# EAGLE design Control Board (EAGLE 6.3)
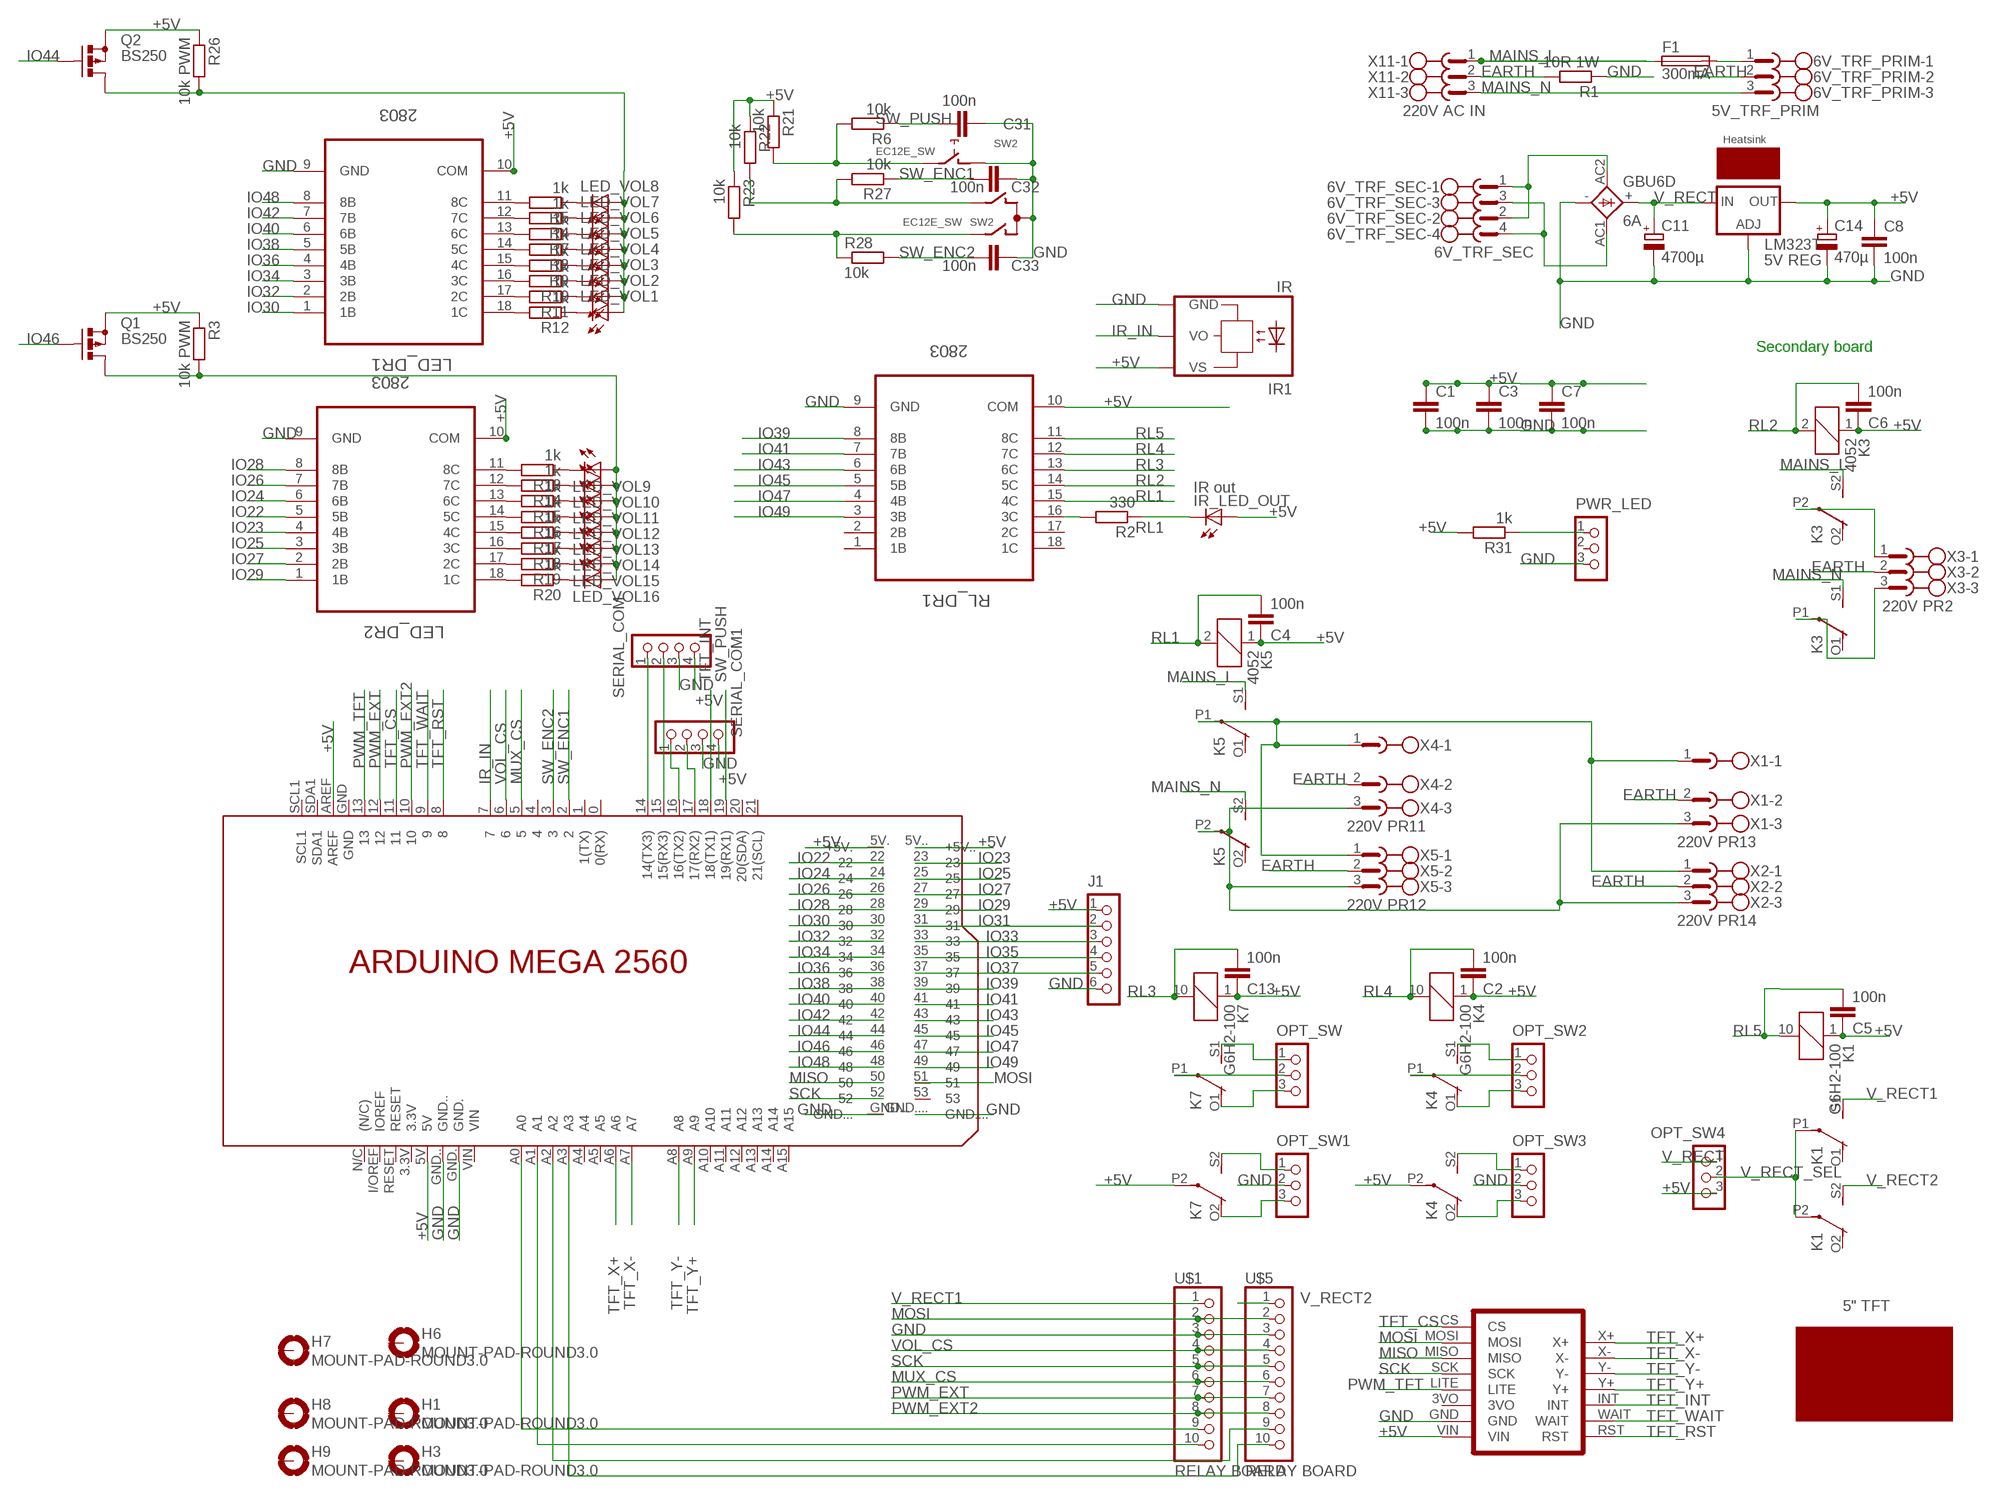
[diagram p0: schematic, sheet 1]

## Parts
6V_TRF_PRIM  5V_TRF_PRIM  MSTBV3  [MSTBV3]
6V_TRF_SEC  6V_TRF_SEC  MSTBV4  [MSTBV4]
C1  100n  C-EU050-025X075  [C050-025X075]
C2  100n  C-EU050-025X075  [C050-025X075]
C3  100n  C-EU050-025X075  [C050-025X075]
C4  100n  C-EU050-025X075  [C050-025X075]
C5  100n  C-EU050-025X075  [C050-025X075]
C6  100n  C-EU050-025X075  [C050-025X075]
C7  100n  C-EU050-025X075  [C050-025X075]
C8  100n  C-EU050-025X075  [C050-025X075]
C11  4700µ  CPOL-EUE7.5-16  [E7,5-16]
C13  100n  C-EU050-025X075  [C050-025X075]
C14  470µ  CPOL-EUE2.5-6  [E2,5-6]
C31  100n  C-EU050-025X075  [C050-025X075]
C32  100n  C-EU050-025X075  [C050-025X075]
C33  100n  C-EU050-025X075  [C050-025X075]
F1  300mA  GSH15  [GSH15]
GBU6D  6A  GBU4  [GBU4S]
H1  MOUNT-PAD-ROUND3.0  [3,0-PAD]
H3  MOUNT-PAD-ROUND3.0  [3,0-PAD]
H6  MOUNT-PAD-ROUND3.0  [3,0-PAD]
H7  MOUNT-PAD-ROUND3.0  [3,0-PAD]
H8  MOUNT-PAD-ROUND3.0  [3,0-PAD]
H9  MOUNT-PAD-ROUND3.0  [3,0-PAD]
IR1  IR  TSOP1738TB1  [TSOP17_TB1]
IR_LED_OUT  IR out  TLLG4400  [LED3MM]
J1  CON_HEADER_1X06-PTH  [M1X6]
K1  G6H2-100  [G6H2-100]
K3  4052  [F4052]
K4  G6H2-100  [G6H2-100]
K5  4052  [F4052]
K7  G6H2-100  [G6H2-100]
LED_DR1  2803  ULN2803ADWR  [SOIC127P1030X265-18N]
LED_DR2  2803  ULN2803ADWR  [SOIC127P1030X265-18N]
LED_VOL1  TLLG4400  [LED3MM]
LED_VOL2  TLLG4400  [LED3MM]
LED_VOL3  TLLG4400  [LED3MM]
LED_VOL4  TLLG4400  [LED3MM]
LED_VOL5  TLLG4400  [LED3MM]
LED_VOL6  TLLG4400  [LED3MM]
LED_VOL7  TLLG4400  [LED3MM]
LED_VOL8  TLLG4400  [LED3MM]
LED_VOL9  TLLG4400  [LED3MM]
LED_VOL10  TLLG4400  [LED3MM]
LED_VOL11  TLLG4400  [LED3MM]
LED_VOL12  TLLG4400  [LED3MM]
LED_VOL13  TLLG4400  [LED3MM]
LED_VOL14  TLLG4400  [LED3MM]
LED_VOL15  TLLG4400  [LED3MM]
LED_VOL16  TLLG4400  [LED3MM]
LM323T  5V REG  LM138-TSTO220S_IAO  [TO220S]
OPT_SW  CON_HEADER_1X03-PTH  [M1X3]
OPT_SW1  CON_HEADER_1X03-PTH  [M1X3]
OPT_SW2  CON_HEADER_1X03-PTH  [M1X3]
OPT_SW3  CON_HEADER_1X03-PTH  [M1X3]
OPT_SW4  V_RECT_-_5V_OUT  CON_HEADER_1X03-PTH  [M1X3]
PCB2  ARDUINO_MEGA2560_INV  [ARDUINO_MEGA2560_INV]
PWR_LED  CON_HEADER_1X03-PTH  [M1X3]
Q1  BS250  [SOT54E]
Q2  BS250  [SOT54E]
R1  10R 1W  R-EU_0411/15  [0411/15]
R2  330  R-EU_0207/10  [0207/10]
R3  10k PWM  R-EU_0207/10  [0207/10]
R4  1k  R-EU_0207/10  [0207/10]
R5  1k  R-EU_0207/10  [0207/10]
R6  10k  R-EU_0207/10  [0207/10]
R7  1k  R-EU_0207/10  [0207/10]
R8  1k  R-EU_0207/10  [0207/10]
R9  1k  R-EU_0207/10  [0207/10]
R10  1k  R-EU_0207/10  [0207/10]
R11  1k  R-EU_0207/10  [0207/10]
R12  1k  R-EU_0207/10  [0207/10]
R13  1k  R-EU_0207/10  [0207/10]
R14  1k  R-EU_0207/10  [0207/10]
R15  1k  R-EU_0207/10  [0207/10]
R16  1k  R-EU_0207/10  [0207/10]
R17  1k  R-EU_0207/10  [0207/10]
R18  1k  R-EU_0207/10  [0207/10]
R19  1k  R-EU_0207/10  [0207/10]
R20  1k  R-EU_0207/10  [0207/10]
R21  10k  R-EU_0207/10  [0207/10]
R22  10k  R-EU_0207/10  [0207/10]
R23  10k  R-EU_0207/10  [0207/10]
R26  10k PWM  R-EU_0207/10  [0207/10]
R27  10k  R-EU_0207/10  [0207/10]
R28  10k  R-EU_0207/10  [0207/10]
R31  1k  R-EU_0207/10  [0207/10]
RL_DR1  2803  ULN2803ADWR  [SOIC127P1030X265-18N]
SERIAL_COM  CON_HEADER_1X04  [M1X4]
SERIAL_COM1  CON_HEADER_1X04  [M1X4]
SW2  EC12E_SW  [ALPS_EC12E_SW]
U$1  RELAY BOARD  PINHD-1X10  [1X10-BIG]
U$2  HEATSINK  [HEATSINK]
U$3  RA8875  [RA8875]
U$4  5"TFT  [5_TFT]
U$5  RELAY BOARD  PINHD-1X10  [1X10-BIG]
X1  220V PR13  MSTBV3  [MSTBV3]
X2  220V PR14  MSTBV3  [MSTBV3]
X3  220V PR2  MSTBV3  [MSTBV3]
X4  220V PR11  MSTBV3  [MSTBV3]
X5  220V PR12  MSTBV3  [MSTBV3]
X11  220V AC IN  MSTBV3  [MSTBV3]

## Nets
+5V [power]: C1.1 C2.1 C3.1 C4.1 C5.1 C6.1 C7.1 C8.1 C13.1 C14.+ IR1.VS IR_LED_OUT.A J1.1 K1.1 K3.1 K4.1 K4.P2(3:P) K5.1 K7.1 K7.P2(3:P) LED_DR1.10(COM) LED_DR2.10(COM) LM323T.3(OUT) OPT_SW4.3 PCB2.5V PCB2.5V.(+5V.) PCB2.5V..(+5V..) PCB2.AREF Q1.S Q2.S R3.1 R21.1 R22.1 R23.1 R26.1 R31.2 RL_DR1.10(COM) SERIAL_COM1.4 SERIAL_COM.4 U$3.VIN
EARTH [earth]: 6V_TRF_PRIM.2 R1.2 X1.2 X2.2 X3.2 X4.2 X5.2 X11.2
GND [power]: C1.2 C3.2 C7.2 C8.2 C11.- C14.- C31.1 C32.1 C33.1 GBU6D.- IR1.GND J1.6 LED_DR1.9(GND) LED_DR2.9(GND) LM323T.2(ADJ) OPT_SW1.2 OPT_SW3.2 PCB2.GND. PCB2.GND.. PCB2.GND... PCB2.GND.... PWR_LED.3 R1.1 RL_DR1.9(GND) SERIAL_COM1.3 SERIAL_COM.3 SW2.C SW2.D U$1.3 U$3.GND U$5.3
IO22: LED_DR2.5(5B) PCB2.22
IO23: LED_DR2.4(4B) PCB2.23
IO24: LED_DR2.6(6B) PCB2.24
IO25: LED_DR2.3(3B) PCB2.25
IO26: LED_DR2.7(7B) PCB2.26
IO27: LED_DR2.2(2B) PCB2.27
IO28: LED_DR2.8(8B) PCB2.28
IO29: LED_DR2.1(1B) PCB2.29
IO30: LED_DR1.1(1B) PCB2.30
IO31: J1.2 PCB2.31
IO32: LED_DR1.2(2B) PCB2.32
IO33: J1.3 PCB2.33
IO34: LED_DR1.3(3B) PCB2.34
IO35: J1.4 PCB2.35
IO36: LED_DR1.4(4B) PCB2.36
IO37: J1.5 PCB2.37
IO38: LED_DR1.5(5B) PCB2.38
IO39: PCB2.39 RL_DR1.8(8B)
IO40: LED_DR1.6(6B) PCB2.40
IO41: PCB2.41 RL_DR1.7(7B)
IO42: LED_DR1.7(7B) PCB2.42
IO43: PCB2.43 RL_DR1.6(6B)
IO44: PCB2.44 Q2.G
IO45: PCB2.45 RL_DR1.5(5B)
IO46: PCB2.46 Q1.G
IO47: PCB2.47 RL_DR1.4(4B)
IO48: LED_DR1.8(8B) PCB2.48
IO49: PCB2.49 RL_DR1.3(3B)
IR_IN: IR1.VO PCB2.7
LED_COMMON_1 [power]: LED_VOL1.A LED_VOL2.A LED_VOL3.A LED_VOL4.A LED_VOL5.A LED_VOL6.A LED_VOL7.A LED_VOL8.A Q2.D R26.2
LED_COMMON_2 [power]: LED_VOL9.A LED_VOL10.A LED_VOL11.A LED_VOL12.A LED_VOL13.A LED_VOL14.A LED_VOL15.A LED_VOL16.A Q1.D R3.2
MAINS_L [mains]: F1.1 K3.S2(3:S) K5.S1(2:S) X11.1
MAINS_N [mains]: 6V_TRF_PRIM.3 K3.S1(2:S) K5.S2(3:S) X11.3
MISO: PCB2.50 U$3.MISO
MOSI: PCB2.51 U$1.2 U$3.MOSI U$5.2
MUX_CS: PCB2.5 U$1.6 U$5.6
N$1: K4.P1(2:P) OPT_SW2.2
N$2: R2.2 RL_DR1.16(3C)
N$3: IR_LED_OUT.K(C) R2.1
N$4: LED_VOL1.K(C) R12.1
N$5: PCB2.14(14(TX3)) SERIAL_COM.1
N$6: PCB2.15(15(RX3)) SERIAL_COM.2
N$7: LED_DR1.11(8C) R5.2
N$8: K4.S1(2:S) OPT_SW2.1
N$9: K4.O1(2:O) OPT_SW2.3
N$10: LED_VOL2.K(C) R11.1
N$11: R6.2 R21.2 SW2.E
N$12: LED_VOL3.K(C) R10.1
N$13: LED_VOL4.K(C) R9.1
N$14: LED_VOL5.K(C) R8.1
N$15: LED_VOL6.K(C) R7.1
N$16: LED_VOL7.K(C) R4.1
N$17: LED_VOL8.K(C) R5.1
N$18: LED_DR2.11(8C) R13.2
N$19: LED_DR2.12(7C) R14.2
N$21: LED_DR2.13(6C) R15.2
N$22: LED_DR2.14(5C) R16.2
N$23: LED_DR2.15(4C) R17.2
N$24: LED_DR2.16(3C) R18.2
N$25: LED_DR2.17(2C) R19.2
N$26: LED_DR2.18(1C) R20.2
N$27: K7.S2(3:S) OPT_SW1.1
N$28: R22.2 R27.2 SW2.B
N$29: LED_DR1.12(7C) R4.2
N$31: LED_DR1.13(6C) R7.2
N$32: K7.P1(2:P) OPT_SW.2
N$33: LED_DR1.14(5C) R8.2
N$34: LED_DR1.15(4C) R9.2
N$35: LED_DR1.16(3C) R10.2
N$36: LED_DR1.17(2C) R11.2
N$37: LED_DR1.18(1C) R12.2
N$38 [power]: 6V_TRF_SEC.3 6V_TRF_SEC.4 GBU6D.AC1(AC2)
N$39 [power]: 6V_TRF_SEC.1 6V_TRF_SEC.2 GBU6D.AC2(AC1)
N$40: K7.O2(3:O) OPT_SW1.3
N$41: LED_VOL9.K(C) R13.1
N$42: LED_VOL10.K(C) R14.1
N$43: LED_VOL11.K(C) R15.1
N$53: LED_VOL12.K(C) R16.1
N$54: LED_VOL13.K(C) R17.1
N$55: LED_VOL14.K(C) R18.1
N$56 [main2]: K3.P1(2:P) X3.3
N$57: LED_VOL15.K(C) R19.1
N$58: LED_VOL16.K(C) R20.1
N$59: K7.S1(2:S) OPT_SW.1
N$60: PCB2.16(16(TX2)) SERIAL_COM1.1
N$61: PCB2.17(17(RX2)) SERIAL_COM1.2
N$62: R23.2 R28.1 SW2.A
N$64: K4.S2(3:S) OPT_SW3.1
N$65 [main2]: K3.P2(3:P) X3.1
N$73 [mains]: 6V_TRF_PRIM.1 F1.2
N$74: K7.O1(2:O) OPT_SW.3
N$75: PCB2.A0 U$1.9
N$84: PCB2.A1 U$1.10
N$85: PCB2.A2 U$5.9
N$86: PCB2.A3 U$5.10
N$123: K4.O2(3:O) OPT_SW3.3
N$138: PWR_LED.1 R31.1
N$139 [mains]: K5.P1(2:P) X1.1 X2.1 X4.1 X5.1
N$141 [main2]: K5.P2(3:P) X1.3 X2.3 X4.3 X5.3
PWM_EXT: PCB2.12 U$1.7 U$5.7
PWM_EXT2: PCB2.10 U$1.8 U$5.8
PWM_TFT: PCB2.13 U$3.LITE
RL1: C4.2 K5.2 RL_DR1.15(4C)
RL2: C6.2 K3.2 RL_DR1.14(5C)
RL3: C13.2 K7.10 RL_DR1.13(6C)
RL4: C2.2 K4.10 RL_DR1.12(7C)
RL5: C5.2 K1.10 RL_DR1.11(8C)
SCK: PCB2.52 U$1.5 U$3.SCK U$5.5
SW_ENC1: C32.2 PCB2.2 R27.1
SW_ENC2: C33.2 PCB2.3 R28.2
SW_PUSH: C31.2 PCB2.19(19(RX1)) R6.1
TFT_CS: PCB2.11 U$3.CS
TFT_INT: PCB2.18(18(TX1)) U$3.INT
TFT_RST: PCB2.8 U$3.RST
TFT_WAIT: PCB2.9 U$3.WAIT
TFT_X+: PCB2.A6 U$3.X+
TFT_X-: PCB2.A7 U$3.X-
TFT_Y+: PCB2.A9 U$3.Y+
TFT_Y-: PCB2.A8 U$3.Y-
V_RECT [power]: C11.+ GBU6D.+ LM323T.1(IN) OPT_SW4.1
V_RECT1 [power]: K1.S1(2:S) U$1.1
V_RECT2 [power]: K1.S2(3:S) U$5.1
V_RECT_SEL [power]: K1.P1(2:P) K1.P2(3:P) OPT_SW4.2
VOL_CS: PCB2.6 U$1.4 U$5.4
Unconnected: H1.B3,0(MOUNT) H3.B3,0(MOUNT) H6.B3,0(MOUNT) H7.B3,0(MOUNT) H8.B3,0(MOUNT) H9.B3,0(MOUNT) K1.O1(2:O) K1.O2(3:O) K3.O1(2:O) K3.O2(3:O) K5.O1(2:O) K5.O2(3:O) PCB2.0(0(RX)) PCB2.1(1(TX)) PCB2.3.3V PCB2.4 PCB2.20(20(SDA)) PCB2.21(21(SCL)) PCB2.53 PCB2.A4 PCB2.A5 PCB2.A10 PCB2.A11 PCB2.A12 PCB2.A13 PCB2.A14 PCB2.A15 PCB2.GND PCB2.I/OREF(IOREF) PCB2.N/C((N/C)) PCB2.RESET PCB2.SCL1 PCB2.SDA1 PCB2.VIN PWR_LED.2 RL_DR1.1(1B) RL_DR1.2(2B) RL_DR1.17(2C) RL_DR1.18(1C) SW2.GND1(G) SW2.GND2(G) U$3.3VO

## Notes on the sheet
- Secondary board

## Library data of the parts
6V_TRF_PRIM X1-X5 X11 = con-phoenix-508:MSTBV3: PHOENIX; MPN: MSTBV 2,5/3-GF-5.08; OC_FARNELL: 1792793; OC_NEWARK: 69R9846
6V_TRF_SEC = con-phoenix-508:MSTBV4: PHOENIX; MPN: MSTBV 2,5/4-GF-5.08; OC_FARNELL: 1792794; OC_NEWARK: 69R9847
C1-C8 C13 C31-C33 = rcl:C-EU: CAPACITOR, European symbol
C11 C14 = rcl:CPOL-EU: POLARIZED CAPACITOR, European symbol
F1 = fuse:GSH15: FUSE HOLDER grid 15mm, 19649 Wickmann; MPN: 64900001039; OC_FARNELL: 1271673; OC_NEWARK: 02P0318
GBU6D = rectifier:GBU4: GENERAL INSTRUMENT RECTIFIER
H1 H3 H6-H9 = holes:MOUNT-PAD-ROUND: MOUNTING PAD, round
IR1 = telefunken:TSOP17*TB1: TSOP17..TB1 IR Receiver Modules for Remote Control Systems Source: http://www.vishay.com/docs/82042/82042.pdf; OC_FARNELL: unknown; OC_NEWARK: unknown
IR_LED_OUT LED_VOL1-LED_VOL16 = led:TLLG4400: Low Current (2mA) LED 3 mm Tinted Diffused Package color GREEN Source: Data sheet <http://www.farnell.com/datasheets/391098.pdf>; MF: VISHAY SEMICONDUCTOR; OC_FARNELL: 1612435
J1 = dp_devices.v6:CON_HEADER_1X06
K1 K4 K7 = relay:G6H2-100: RELAY 2 x switch, 0.5 A/125 V AC, 1 A/30 V DC, Omron; OC_FARNELL: unknown; OC_NEWARK: unknown
K3 K5 = relay:4052: RELAY 2 x switch, Finder; OC_FARNELL: unknown; OC_NEWARK: unknown
LED_DR1 LED_DR2 RL_DR1 = uln-udn:ULN2803ADWR: Darlington transistor array; MPN: ULN2803ADWR; OC_FARNELL: 1652420; OC_NEWARK: 87H4769; PACKAGE: SOIC-18; SUPPLIER: TEXAS INSTRUMENTS
LM323T = v-reg:LM138-TS: VOLTAGE REGULATOR
OPT_SW OPT_SW1-OPT_SW4 PWR_LED = dp_devices.v6:CON_HEADER_1X03
PCB2 = E14_Arduino_revB:ARDUINO_MEGA2560_INV
Q1 Q2 = transistor-small-signal:BS250: P-CHANNEL MOS FET
R1-R23 R26-R28 R31 = rcl:R-EU_: RESISTOR, European symbol
SERIAL_COM SERIAL_COM1 = dp_devices.v6:CON_HEADER_1X04
SW2 = switch-alps:EC12E_SW: ALPS rotary Encoder EC12E series with switch; MPN: EC12E2424407; OC_FARNELL: 1520813; OC_NEWARK: 74M1068
U$1 U$5 = adafruit:PINHD-1X10: Pin header 1x10 0.1" spacing With round pins
U$2 = gael:HEATSINK
U$3 = gael:RA8875
U$4 = gael:5"TFT

## Net classes
0 default: width 0.254 mm, clearance 0.203 mm
1 mains: width 0.508 mm, clearance 2.5 mm
2 earth: width 1.27 mm, clearance 0.508 mm
3 main2: width 0.508 mm, clearance 1.5 mm
4 power: width 0.508 mm, clearance 0.203 mm

## Board
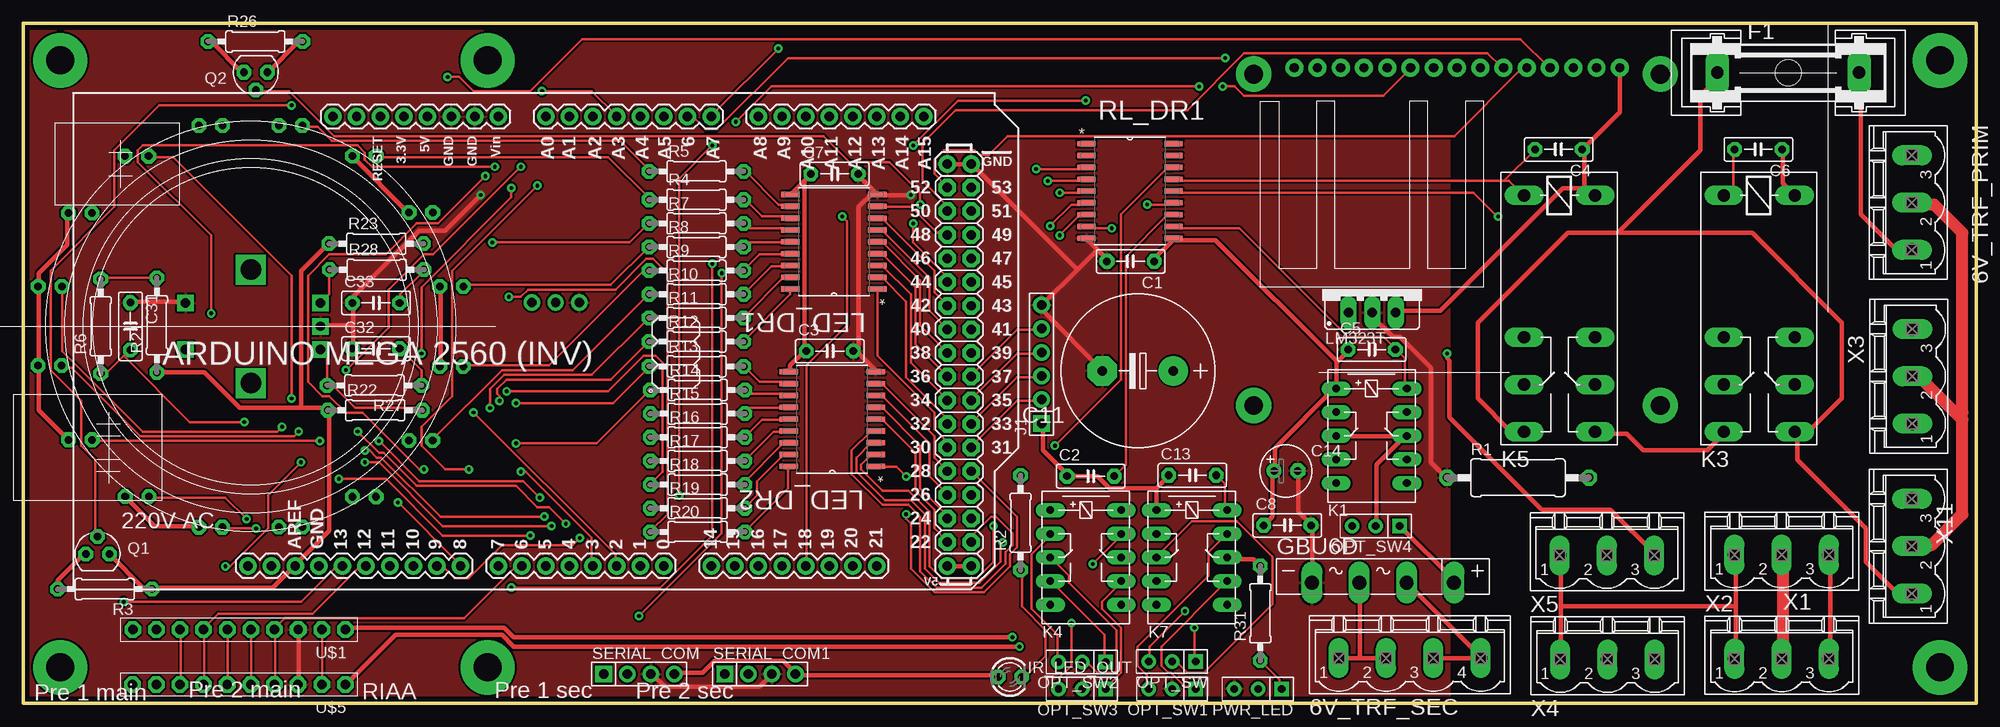
[diagram p1: board, top side]
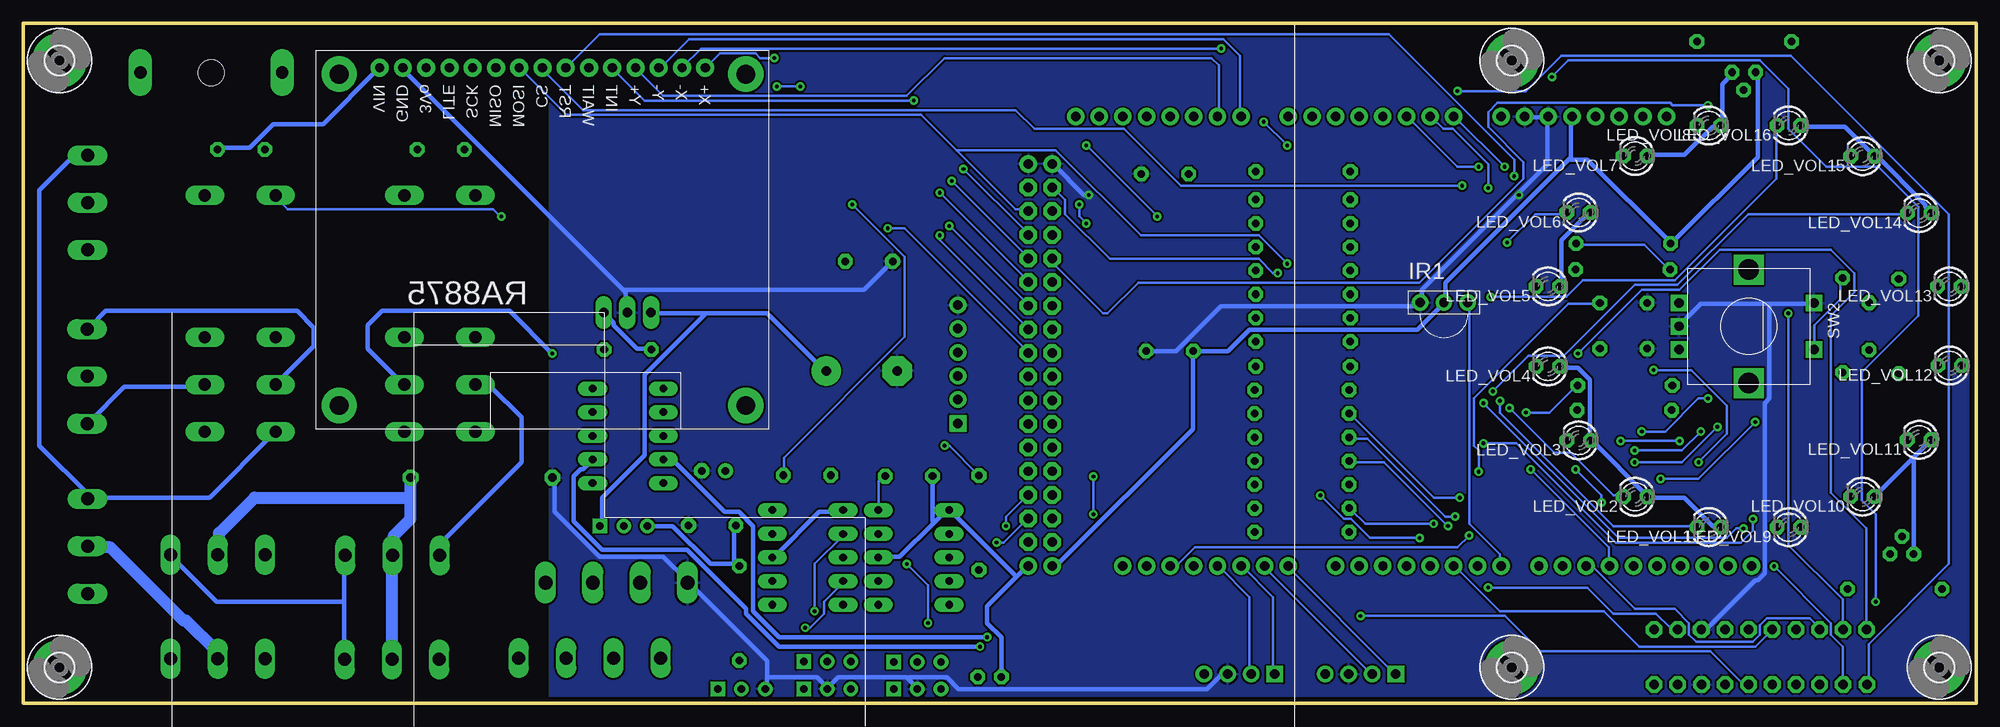
[diagram p2: board, bottom side, seen from below]

Size 209.89 x 73.08 mm. Coordinates in mm from the lower left corner, seen from the top.
Outline: 209.89,0 0,0 0,73.08 209.89,73.08 209.89,0
Copper layers (1*16): Top 0.035mm / dielectric 1.5mm / Bottom 0.035mm
Design rules "gael design rules": minimum track width 0.2mm, minimum drill 0.4mm, track to track 8mil, track to pad 8mil, pad to pad 8mil, via to via 8mil, smd to smd 8mil, copper to edge 20mil, drill to drill 8mil, minimum pad ring 15mil, minimum via ring 10mil, stop-mask expansion 4mil, vias tented up to drill 0mil, thermal gap 10mil

### Footprints (pad centres in the part's own frame; a part is rotated, then mirrored left to right if it is on the bottom)
MSTBV3 = drill 1.397 long: 1 -5.08,0; 2 0,0; 3 5.08,0
MSTBV4 = drill 1.397 long: 1 -7.62,0; 2 -2.54,0; 3 2.54,0; 4 7.62,0
C050-025X075 = drill 0.813 octagon: 1 -2.54,0; 2 2.54,0
E7,5-16 = drill 1.016 pad 3.15: + -3.81,0 | drill 1.016 pad 3.15 octagon: - 3.81,0
E2,5-6 = drill 0.813 pad 1.6: + -1.27,0 | drill 0.813 pad 1.6 octagon: - 1.27,0
GSH15 = drill 1.321 pad 2.54 long: 1 -7.62,0; 2 7.62,0 | hole 2.794: 0,0
GBU4S = drill 1.499 long: + 7.62,0; - -7.62,0; AC1 2.54,0; AC2 -2.54,0
3,0-PAD = drill 3 pad 5.842: B3,0 0,0
TSOP17_TB1 = drill 1 pad 1.676: GND 0,-3.81; VO 0,1.27; VS 0,-1.27
LED3MM = drill 0.813 octagon: A -1.27,0; K 1.27,0
M1X6 = drill 1.02 pad 1.632 square: 1 0,0 | drill 1.02 pad 1.632: 2 2.54,0; 3 5.08,0; 4 7.62,0; 5 10.16,0; 6 12.7,0
G6H2-100 = drill 0.813 long: 1 -5.08,-3.81; 5 5.08,-3.81; 6 5.08,3.81; 10 -5.08,3.81; O1 -2.54,-3.81; O2 -2.54,3.81; P1 0,-3.81; P2 0,3.81; S1 2.54,-3.81; S2 2.54,3.81
F4052 = drill 1.321 long: 1 -3.81,3.81; 2 -3.81,-3.81; O1 11.43,-3.81; O2 11.43,3.81; P1 16.51,-3.81; P2 16.51,3.81; S1 21.59,-3.81; S2 21.59,3.81
SOIC127P1030X265-18N = smd 1.981 x 0.559: 1 -4.674,5.08; 2 -4.674,3.81; 3 -4.674,2.54; 4 -4.674,1.27; 5 -4.674,0; 6 -4.674,-1.27; 7 -4.674,-2.54; 8 -4.674,-3.81; 9 -4.674,-5.08; 10 4.674,-5.08; 11 4.674,-3.81; 12 4.674,-2.54; 13 4.674,-1.27; 14 4.674,0; 15 4.674,1.27; 16 4.674,2.54; 17 4.674,3.81; 18 4.674,5.08
TO220S = drill 1.016 long: 1 -2.54,-2.54; 2 0,-2.54; 3 2.54,-2.54
M1X3 = drill 0.8 square: 1 0,0 | drill 0.8: 2 2.54,0; 3 5.08,0
ARDUINO_MEGA2560_INV = drill 1.016 pad 1.88: 0 63.5,2.54; 1 60.96,2.54; 2 58.42,2.54; 3 55.88,2.54; 3.3V 35.56,50.8; 4 53.34,2.54; 5 50.8,2.54; 5V 38.1,50.8; 5V. 93.98,2.54; 5V.. 96.52,2.54; 6 48.26,2.54; 7 45.72,2.54; 8 41.656,2.54; 9 39.116,2.54; 10 36.576,2.54; 11 34.036,2.54; 12 31.496,2.54; 13 28.956,2.54; 14 68.58,2.54; 15 71.12,2.54; 16 73.66,2.54; 17 76.2,2.54; 18 78.74,2.54; 19 81.28,2.54; 20 83.82,2.54; 21 86.36,2.54; A0 50.8,50.8; A1 53.34,50.8; A2 55.88,50.8; A3 58.42,50.8; A4 60.96,50.8; A5 63.5,50.8; A6 66.04,50.8; A7 68.58,50.8; A8 73.66,50.8; A9 76.2,50.8; A10 78.74,50.8; A11 81.28,50.8; A12 83.82,50.8; A13 86.36,50.8; A14 88.9,50.8; A15 91.44,50.8; AREF 23.876,2.54; GND 26.416,2.54; GND. 43.18,50.8; GND.. 40.64,50.8; GND... 93.98,45.72; GND.... 96.52,45.72; I/OREF 30.48,50.8; N/C 27.94,50.8; RESET 33.02,50.8; SCL1 18.796,2.54; SDA1 21.336,2.54; VIN 45.72,50.8 | drill 1.016 pad 1.88 octagon: 22 93.98,5.08; 23 96.52,5.08; 24 93.98,7.62; 25 96.52,7.62; 26 93.98,10.16; 27 96.52,10.16; 28 93.98,12.7; 29 96.52,12.7; 30 93.98,15.24; 31 96.52,15.24; 32 93.98,17.78; 33 96.52,17.78; 34 93.98,20.32; 35 96.52,20.32; 36 93.98,22.86; 37 96.52,22.86; 38 93.98,25.4; 39 96.52,25.4; 40 93.98,27.94; 41 96.52,27.94; 42 93.98,30.48; 43 96.52,30.48; 44 93.98,33.02; 45 96.52,33.02; 46 93.98,35.56; 47 96.52,35.56; 48 93.98,38.1; 49 96.52,38.1; 50 93.98,40.64; 51 96.52,40.64; 52 93.98,43.18; 53 96.52,43.18
SOT54E = drill 0.813 octagon: D -1.27,0; G 0,1.905; S 1.27,0
0411/15 = drill 0.914 octagon: 1 -7.62,0; 2 7.62,0
0207/10 = drill 0.813 octagon: 1 -5.08,0; 2 5.08,0
M1X4 = drill 1.02 pad 1.632 square: 1 0,0 | drill 1.02 pad 1.632: 2 2.54,0; 3 5.08,0; 4 7.62,0
ALPS_EC12E_SW = drill 1 square: A -2.5,-7.5; B 2.5,-7.5; C 0,-7.5; D -2.5,7; E 2.5,7 | drill 2.2 square: GND1 -6.1,0; GND2 6.1,0
1X10-BIG = drill 1.016 pad 1.778 octagon: 1 -11.43,0; 2 -8.89,0; 3 -6.35,0; 4 -3.81,0; 5 -1.27,0; 6 1.27,0; 7 3.81,0; 8 6.35,0; 9 8.89,0; 10 11.43,0
RA8875 = drill 1 pad 1.93: 3VO 11.85,1.8; CS 24.35,1.8; GND 9.35,1.8; INT 31.85,1.8; LITE 14.35,1.8; MISO 19.35,1.8; MOSI 21.85,1.8; RST 26.85,1.8; SCK 16.85,1.8; VIN 6.85,1.8; WAIT 29.35,1.8; X+ 41.85,1.8; X- 39.35,1.8; Y+ 34.35,1.8; Y- 36.85,1.8 | drill 2 pad 3.81: P$1 2.5,2.5; P$2 46.2,2.5; P$3 2.5,38.1; P$4 46.2,38.1

### Placement (x,y rotation side)
6V_TRF_PRIM  202.97,53.8 90 top
6V_TRF_SEC  149.01,4.86 0 top
C1  119.01,47.5 180 top
C2  114.71,24.41 0 top
C3  86.68,37.85 0 top
C4  165.01,59.53 180 top
C5  144.93,38.02 0 top
C6  186.47,59.53 180 top
C7  87.19,56.9 0 top
C8  135.85,19.13 0 top
C11  119.78,35.72 180 top
C13  125.65,24.51 0 top
C14  135.7,24.98 0 top
C31  11.52,40.51 270 top
C32  37.91,38.11 0 top
C33  37.91,43.03 0 top
F1  189.68,67.77 0 top
GBU6D  146.14,12.98 0 top
H1  206,69.09 0 bottom
H3  3.97,69.09 0 bottom
H6  49.91,3.87 0 bottom
H7  206,3.87 0 bottom
H8  49.91,69.09 0 bottom
H9  3.97,3.87 0 bottom
IR1  55.94,43.07 270 bottom
IR_LED_OUT  106.03,2.84 0 top
J1  109.43,30.09 90 top
K1  144.89,28.75 270 top
K3  186.57,50.77 270 top
K4  114.2,15.68 270 top
K5  165.11,50.77 270 top
K7  125.6,15.68 270 top
LED_DR1  87.13,49.59 180 top
LED_DR2  86.94,30.54 180 top
LED_VOL1  28.74,18.94 180 bottom
LED_VOL2  36.65,22.2 180 bottom
LED_VOL3  42.73,28.26 180 bottom
LED_VOL4  46.03,36.21 180 bottom
LED_VOL5  46.03,44.81 180 bottom
LED_VOL6  42.73,52.75 180 bottom
LED_VOL7  36.66,58.81 180 bottom
LED_VOL8  28.74,62.09 180 bottom
LED_VOL9  20.14,18.93 180 bottom
LED_VOL10  12.23,22.21 180 bottom
LED_VOL11  6.13,28.32 180 bottom
LED_VOL12  2.85,36.3 180 bottom
LED_VOL13  2.87,44.8 180 bottom
LED_VOL14  6.12,52.68 180 bottom
LED_VOL15  12.21,58.79 180 bottom
LED_VOL16  20.15,62.09 180 bottom
LM323T  144.97,44.52 0 top
OPT_SW  126.01,4.49 180 top
OPT_SW1  126.02,1.55 180 top
OPT_SW2  116.34,4.46 180 top
OPT_SW3  116.34,1.54 180 top
OPT_SW4  147.91,19.07 180 top
PCB2  5.35,12.24 0 top
PWR_LED  135.24,1.55 180 top
Q1  7.99,16.04 0 top
Q2  24.99,67.81 180 top
R1  160.64,24.25 0 top
R2  107.18,19.41 90 top
R3  8.77,12.28 180 top
R4  72.35,54.12 0 top
R5  72.35,57.17 0 top
R6  8.32,40.52 90 top
R7  72.35,51.58 0 top
R8  72.35,49.04 0 top
R9  72.35,46.5 0 top
R10  72.35,43.96 0 top
R11  72.35,41.42 0 top
R12  72.35,38.88 0 top
R13  72.35,36.21 0 top
R14  72.47,33.67 0 top
R15  72.47,31.13 0 top
R16  72.47,28.59 0 top
R17  72.47,26.05 0 top
R18  72.47,23.51 0 top
R19  72.47,20.97 0 top
R20  72.47,18.43 0 top
R21  14.36,40.64 90 top
R22  37.81,31.5 0 top
R23  37.94,49.4 0 top
R26  24.94,71.12 0 top
R27  37.74,34.17 180 top
R28  37.99,46.6 0 top
R31  132.95,9.68 90 top
RL_DR1  118.94,55.05 0 top
SERIAL_COM  62.37,3.15 0 top
SERIAL_COM1  75.38,3.15 0 top
SW2  24.45,40.51 270 bottom
U$1  23.2,7.92 180 top
U$2  144.97,44.72 180 top
U$3  178.44,70.1 180 top
U$4  193.94,73.02 180 top
U$5  23.19,2.03 180 top
X1  188.99,4.79 0 top
X2  188.99,15.97 0 top
X3  203.03,35.15 90 top
X4  170.27,4.73 0 top
X5  170.2,15.91 0 top
X11  202.97,16.89 90 top

### Tracks (layer width: path | path; a pad name or v marks a point on that pad's centre or on a via)
+5V
  Top 0.508: Q1.S 9.28,16 12.83,12.45 13.6,12.45 R3.1 13.85,12.45 26.8,12.45 29.09,14.73 PCB2.AREF 29.34,14.99 32.9,18.54 32.9,31.5 R22.1 32.65,31.75 29.85,31.75 | Q2.S 23.5,67.82 20.2,71.12 19.95,71.12 R26.1 | 29.85,31.75 23.25,31.75 19.44,35.56 14.61,35.56 R21.1 | 29.85,31.75 29.85,46.48 32.65,49.28 R23.1 | C6.1 189.11,59.44 189.11,55.88 190.38,54.61 K3.1 | U$3.VIN 171.58,68.07 171.58,63.5 167.77,59.69 C4.1 167.77,59.44 167.77,55.63 168.79,54.61 K5.1 167.77,55.37 165.49,55.37 152.28,42.16 147.71,42.16 LM323T.3 | C1.1 121.55,47.75 123.58,49.78 RL_DR1.10 123.83,49.78 128.15,49.78 141.1,36.83 141.23,36.7 | 141.23,36.7 142.37,37.85 C5.1 | 141.23,36.7 141.1,36.58 141.1,34.04 K1.1 140.85,33.78 134.5,27.43 134.5,25.15 C14.+ 134.25,24.89 134.25,20.07 133.48,19.3 C8.1 | 83.95,37.85 82.43,36.32 82.43,35.81 LED_DR2.10 | 83.95,37.85 C3.1 83.95,37.85 | 83.83,56.01 84.72,56.9 C7.1 | 83.83,56.01 82.68,54.86 LED_DR1.10 | 83.95,37.85 83.95,55.88 83.83,56.01 | PCB2.5V. 99.45,14.73 101.73,14.73 PCB2.5V.. | 121.8,23.11 121.8,20.83 K7.1 | 121.8,23.11 123.07,24.38 C13.1 | K7.P2 129.42,15.49 132.21,15.49 132.72,14.99 R31.2 | 121.8,23.11 116.72,23.11 115.45,24.38 112.4,24.38 C2.1 112.15,24.64 109.61,27.18 109.61,29.97 J1.1 | SERIAL_COM.4 70.24,3.3 73.03,3.3 74.3,4.57 81.67,4.57 82.94,3.3 SERIAL_COM1.4 83.19,3.05 104.53,3.05 IR_LED_OUT.A
  Bottom 0.508: 43.69,58.55 43.57,58.67 43.57,62.99 PCB2.5V | 43.69,58.55 57.03,45.21 57.03,43.18 IR1.VS 57.28,42.93 60.08,40.13 78.11,40.13 80.4,37.85 83.95,37.85 C3.1 84.21,37.85 84.21,29.46 98.69,14.99 99.19,14.99 PCB2.5V. | Q2.S 23.5,67.56 23.5,58.67 32.65,49.53 R23.1 32.9,49.53 41.79,58.42 43.57,58.42 43.69,58.55 | C6.1 188.86,59.69 185.55,59.69 183.01,62.23 177.68,62.23 171.84,68.07 U$3.VIN | LM323T.3 147.45,41.91 146.44,40.89 146.44,40.64 143.9,38.1 142.63,38.1 C5.1 | 103.13,13.59 101.99,14.73 PCB2.5V.. | 103.13,13.59 106.31,10.41 106.31,8.64 104.78,7.11 104.78,3.05 IR_LED_OUT.A | 112.02,19.43 110.62,20.83 K4.1 110.37,20.83 103.26,13.72 103.13,13.59 | 112.02,19.43 115.7,15.75 117.99,15.75 K4.P2 | C2.1 112.15,24.38 112.15,19.56 112.02,19.43 | 133.48,14.99 132.98,14.99 R31.2 133.48,14.99 | 133.48,14.99 136.02,14.99 140.09,19.05 142.63,19.05 OPT_SW4.3 | 133.48,14.99 133.48,19.05 C8.1 | K7.1 121.8,20.57 124.34,20.57 129.17,15.75 K7.P2
EARTH
  Top 1.27: X1.2 189.11,4.83 189.11,15.75 X2.2 | 208.03,30.86 208.41,30.48 208.41,20.32 205.11,17.02 203.08,17.02 X11.2 | 208.03,30.86 203.84,35.05 203.08,35.05 X3.2 | 6V_TRF_PRIM.2 203.08,53.59 205.37,53.59 208.41,50.55 208.41,31.24 208.03,30.86
  Bottom 1.27: X4.2 170.31,4.83 170.31,15.49 X5.2 170.06,16.51 170.06,18.03 168.28,19.81 168.28,22.1 | X11.2 202.83,16.76 200.54,16.76 192.67,8.89 192.41,8.89 189.11,5.59 189.11,4.83 X1.2 | 168.28,22.1 168.28,24.13 R1.2 | 168.28,22.1 168.79,22.1 185.05,22.1 188.86,18.29 188.86,16 X2.2
GND  (via drill 0.4)
  Top 0.508: U$5.3 29.6,2.03 29.6,7.87 U$1.3 | C31.1 11.56,43.18 17.41,43.18 SW2.D | 35.44,40.64 35.44,42.93 C33.1 35.44,43.18 35.44,43.69 42.55,50.8 45.35,50.8 v49.16,54.61 | 35.44,40.64 35.44,38.35 C32.1 | 35.44,40.64 32.14,40.64 SW2.C | LED_DR1.9 91.57,54.86 89.54,56.9 C7.2 | LED_DR2.9 91.57,35.81 89.54,37.85 89.29,37.85 C3.2 89.8,37.85 89.8,53.34 91.32,54.86 LED_DR1.9 | PCB2.GND... 99.45,57.91 101.73,57.91 PCB2.GND.... 101.99,57.91 113.16,46.74 113.29,46.61 | 115.45,48.77 116.47,47.75 C1.2 | 115.45,48.77 114.43,49.78 RL_DR1.9 | GBU6D.- 138.56,13.21 138.56,19.05 C8.2 138.31,19.3 137.04,20.57 137.04,24.89 C14.- | LM323T.2 145.17,41.91 145.17,41.4 147.2,39.37 147.96,39.37 151.26,36.07 151.26,25.91 152.79,24.38 R1.1 | v95.38,54.61 91.83,54.61 LED_DR1.9 | SERIAL_COM.3 67.7,3.05 68.97,1.78 79.13,1.78 80.4,3.05 SERIAL_COM1.3 | 115.45,48.77 113.29,46.61 | 113.29,46.61 109.61,42.93 J1.6 109.61,42.67 109.61,42.16 115.96,35.81 C11.-
  Bottom 0.508: 22.23,42.93 29.6,42.93 31.88,40.64 SW2.C | 22.23,42.93 17.66,42.93 SW2.D | 22.23,42.93 22.23,32.77 22.74,32.26 22.74,13.97 23.5,13.21 23.76,13.21 28.84,8.13 29.34,8.13 U$1.3 | 49.28,54.74 46.11,57.91 46.11,62.99 PCB2.GND.. 46.36,62.99 48.39,62.99 PCB2.GND. | 49.28,54.74 59.57,44.45 59.57,43.18 IR1.GND 59.82,42.93 60.08,42.67 81.16,42.67 85.99,37.85 89.03,37.85 C3.2 | v49.16,54.61 49.28,54.74 | R1.1 152.79,24.13 152.79,20.57 147.96,15.75 141.1,15.75 138.56,13.21 GBU6D.- 138.31,12.95 129.93,4.57 129.93,2.79 | 145.29,44.32 145.17,44.2 145.17,42.16 LM323T.2 | 145.29,44.32 169.04,68.07 U$3.GND | 129.93,2.79 129.93,2.03 PWR_LED.3 | v95.38,54.61 95.89,54.61 99.19,57.91 PCB2.GND... | 114.81,2.67 114.94,2.79 122.31,2.79 123.32,1.78 OPT_SW1.2 123.58,1.78 124.59,2.79 129.93,2.79 | 114.81,2.67 113.93,1.78 OPT_SW3.2 | C1.2 119.51,44.45 145.17,44.45 145.29,44.32 | SERIAL_COM1.3 80.65,3.05 81.16,3.05 82.68,1.52 109.35,1.52 110.62,2.79 114.69,2.79 114.81,2.67
  pour Top: 153.3,-0.25 -1.64,-0.25 -1.64,74.72 153.3,74.72
  pour Bottom: 153.3,73.45 -1.15,73.45 -1.15,-0.25 153.3,-0.25
IO22
  Top 0.254: LED_DR2.5 91.83,30.48 92.34,30.48 95.89,26.92 95.89,22.86 97.92,20.83 97.92,18.8 99.19,17.53 PCB2.22
IO23
  Top 0.254: LED_DR2.4 91.57,29.21 91.07,29.21 89.03,27.18 89.03,24.64 92.34,21.34 95.13,21.34 96.4,20.07 96.4,14.22 98.18,12.45 103,12.45 105.54,14.99 105.54,16.26 106.31,17.02 106.31,18.29 104.53,20.07 104.02,20.07 101.99,18.03 101.99,17.53 PCB2.23
IO24
  Top 0.254: LED_DR2.6 91.83,31.75 92.34,31.75 96.4,27.69 96.4,23.11 99.45,20.07 PCB2.24
IO25  (via drill 0.4)
  Top 0.254: v105.29,17.27 105.04,17.02 105.04,15.24 102.75,12.95 98.43,12.95 96.91,14.48 96.91,20.32 95.38,21.84 92.59,21.84 89.54,24.89 89.54,26.42 91.07,27.94 91.57,27.94 LED_DR2.3
  Bottom 0.254: v105.29,17.27 104.53,17.27 101.99,19.81 PCB2.25
IO26
  Top 0.254: LED_DR2.7 91.83,33.02 92.34,33.02 97.42,27.94 97.42,24.38 99.19,22.61 PCB2.26
IO27  (via drill 0.4)
  Top 0.254: v104.27,19.05 104.27,15.24 102.5,13.46 98.69,13.46 97.42,14.73 97.42,20.57 95.13,22.86 92.34,22.86 90.05,25.15 90.05,25.65 91.07,26.67 91.57,26.67 LED_DR2.2
  Bottom 0.254: v104.27,19.05 104.27,20.07 101.99,22.35 PCB2.27
IO28
  Top 0.254: LED_DR2.8 91.83,34.29 92.34,34.29 97.92,28.7 97.92,26.42 99.19,25.15 PCB2.28
IO29  (via drill 0.4)
  Top 0.254: v94.88,24.38 93.86,25.4 91.83,25.4 LED_DR2.1 | v94.88,20.32 94.88,19.81 95.38,19.3 95.38,14.48 97.92,11.94 103.26,11.94 106.05,14.73 106.05,16 106.81,16.76 106.81,20.07 101.99,24.89 PCB2.29
  Bottom 0.254: v94.88,20.32 v94.88,24.38
IO30
  Top 0.254: LED_DR1.1 91.83,44.45 91.83,37.34 97.92,31.24 97.92,29.46 99.19,28.19 99.19,27.69 PCB2.30
IO31
  Top 0.254: J1.2 109.35,32.51 106.81,32.51 101.99,27.69 PCB2.31
IO32
  Top 0.254: LED_DR1.2 91.83,45.72 92.34,45.72 94.88,43.18 94.88,35.05 99.19,30.73 99.19,30.23 PCB2.32
IO33
  Top 0.254: J1.3 109.35,35.05 106.81,35.05 101.99,30.23 PCB2.33
IO34
  Top 0.254: LED_DR1.3 91.83,46.99 92.34,46.99 95.38,43.94 95.38,36.58 99.19,32.77 PCB2.34
IO35
  Top 0.254: J1.4 109.35,37.59 106.81,37.59 101.99,32.77 PCB2.35
IO36
  Top 0.254: LED_DR1.4 91.83,48.26 92.34,48.26 95.89,44.7 95.89,38.61 99.19,35.31 PCB2.36
IO37
  Top 0.254: J1.5 109.35,40.13 106.81,40.13 101.99,35.31 PCB2.37
IO38
  Top 0.254: LED_DR1.5 91.83,49.53 92.34,49.53 96.4,45.47 96.4,40.64 99.19,37.85 PCB2.38
IO39  (via drill 0.4)
  Top 0.254: v116.97,51.05 114.43,51.05 RL_DR1.8
  Bottom 0.254: v116.97,51.05 115.2,51.05 101.99,37.85 PCB2.39
IO40
  Top 0.254: LED_DR1.6 91.83,50.8 92.34,50.8 97.42,45.72 97.42,42.16 99.19,40.39 PCB2.40
IO41  (via drill 0.4)
  Top 0.254: v111.39,50.29 113.42,52.32 114.18,52.32 RL_DR1.7
  Bottom 0.254: v111.39,50.29 111.39,49.78 101.99,40.39 PCB2.41
IO42
  Top 0.254: LED_DR1.7 91.83,52.07 92.34,52.07 97.92,46.48 97.92,44.2 99.19,42.93 PCB2.42
IO43  (via drill 0.4)
  Top 0.254: v110.37,51.31 112.66,53.59 114.18,53.59 RL_DR1.6
  Bottom 0.254: v110.37,51.31 101.99,42.93 PCB2.43
IO44  (via drill 0.4)
  Top 0.254: v96.4,53.59 96.4,54.86 93.1,58.17 88.78,58.17 85.99,60.96 33.41,60.96 28.58,65.79 25.03,65.79 Q2.G | v95.64,51.56 95.64,49.53 99.19,45.97 99.19,45.47 PCB2.44
  Bottom 0.254: v96.4,53.59 96.4,52.32 v95.64,51.56
IO45  (via drill 0.4)
  Top 0.254: v111.39,54.86 114.18,54.86 RL_DR1.5
  Bottom 0.254: v111.39,54.86 101.99,45.47 PCB2.45
IO46  (via drill 0.4)
  Top 0.254: v28.84,64.26 14.61,64.26 9.79,59.44 9.79,53.34 2.93,46.48 2.93,35.81 6.23,32.51 6.23,27.69 7.75,26.16 7.75,18.03 Q1.G
  Bottom 0.254: v28.84,64.26 32.65,64.26 32.9,64.52 51.44,64.52 52.46,63.5 52.46,61.98 48.65,58.17 48.65,56.39 59.82,45.21 90.05,45.21 93.35,41.91 93.86,41.91 99.19,47.24 99.19,47.75 PCB2.46
IO47  (via drill 0.4)
  Top 0.254: v110.12,56.13 114.18,56.13 RL_DR1.4
  Bottom 0.254: v110.12,56.13 101.99,48.01 PCB2.47
IO48
  Top 0.254: LED_DR1.8 91.83,53.34 95.38,53.34 98.18,50.55 99.19,50.55 PCB2.48
IO49  (via drill 0.4)
  Top 0.254: v108.85,57.4 114.18,57.4 RL_DR1.3
  Bottom 0.254: v108.85,57.4 101.99,50.55 PCB2.49
IR_IN
  Bottom 0.254: IR1.VO 54.49,42.93 54.49,19.3 51.19,16 51.19,14.99 PCB2.7
LED_COMMON_1
  Top 0.508: Q2.D 26.3,67.82 29.6,71.12 29.85,71.12 R26.2 | LED_VOL4.A 44.84,36.32 44.84,44.7 LED_VOL5.A | LED_VOL6.A 41.28,52.83 35.44,58.67 LED_VOL7.A
  Bottom 0.508: LED_VOL1.A 27.57,19.05 28.33,19.05 31.38,22.1 35.19,22.1 LED_VOL2.A 35.44,22.35 41.28,28.19 LED_VOL3.A 41.54,28.45 41.54,34.8 42.81,36.07 44.58,36.07 LED_VOL4.A | Q2.D 26.3,67.56 27.31,66.55 27.31,62.23 LED_VOL8.A 27.57,61.98 28.33,61.98 31.38,58.93 35.19,58.93 LED_VOL7.A | LED_VOL5.A 44.58,44.96 44.58,49.78 41.54,52.83 LED_VOL6.A
LED_COMMON_2
  Top 0.508: R3.2 3.69,12.45 3.69,13.21 6.48,16 Q1.D | LED_VOL9.A 18.68,19.05 14.1,19.05 11.06,22.1 LED_VOL10.A | LED_VOL11.A 4.71,28.45 1.66,31.5 1.66,36.07 LED_VOL12.A 1.66,36.32 1.66,44.7 LED_VOL13.A 1.66,44.96 1.66,46.23 4.71,49.28 4.71,52.58 LED_VOL14.A
  Bottom 0.508: LED_VOL14.A 4.96,52.83 5.47,53.34 5.47,53.59 10.8,58.93 LED_VOL15.A 11.06,58.93 14.1,61.98 18.68,61.98 LED_VOL16.A | 6.86,26.29 4.96,28.19 LED_VOL11.A | 6.86,26.29 10.8,22.35 LED_VOL10.A | Q1.D 6.74,16.26 6.74,26.16 6.86,26.29
MAINS_L
  Top 0.508: X11.1 202.83,11.94 201.3,11.94 198,15.24 198,18.8 190.63,26.16 190.63,28.96 K3.S2 190.89,28.96 191.65,28.96 195.46,32.77 195.46,40.89 185.81,50.55 171.58,50.55 171.46,50.67 | 171.46,50.67 180.22,59.44 180.22,65.28 182,67.06 182,67.56 F1.1 | 171.46,50.67 171.33,50.55 166,50.55 156.34,40.89 156.34,32.77 159.9,29.21 161.17,29.21 K5.S1
MAINS_N
  Top 0.508: K5.S2 169.04,28.96 172.35,28.96 174.12,27.18 180.98,27.18 182.76,28.96 K3.S1
  Bottom 0.508: K3.S1 183.01,28.96 189.87,22.1 202.83,22.1 X11.3 202.83,22.35 208.16,27.69 208.16,55.12 204.6,58.67 203.08,58.67 6V_TRF_PRIM.3
MISO
  Top 0.254: PCB2.50 99.19,53.09 99.19,53.59 96.65,56.13 96.65,60.2 100.21,63.75 125.1,63.75 131.2,69.85 157.36,69.85 158.88,68.33 U$3.MISO
MOSI  (via drill 0.4)
  Top 0.254: U$5.2 32.14,2.03 32.14,7.87 U$1.2 | v52.46,12.45 68.46,12.45 74.05,18.03 v74.05,47.24
  Bottom 0.254: 109.61,59.44 113.42,63.25 151.52,63.25 156.34,68.07 U$3.MOSI | 109.61,59.44 103.26,53.09 101.99,53.09 PCB2.51 | v52.46,12.45 41.79,12.45 39,9.65 34.42,9.65 32.9,8.13 32.14,8.13 U$1.2 | v74.05,47.24 77.1,50.29 89.8,50.29 98.94,59.44 109.61,59.44
MUX_CS
  Top 0.254: U$5.6 21.98,2.03 21.98,7.87 U$1.6
  Bottom 0.254: PCB2.5 56.01,14.73 51.19,9.91 40.01,9.91 36.2,6.1 23.76,6.1 21.98,7.87 U$1.6
N$1
  Top 0.254: OPT_SW2.2 113.93,4.32 114.43,4.32 115.45,3.3 117.23,3.3 117.48,3.56 117.48,7.87 112.4,12.95 112.4,13.72 110.62,15.49 K4.P1
N$2  (via drill 0.4)
  Top 0.254: v110.88,27.69 117.99,34.8 117.99,52.58 122.82,57.4 123.58,57.4 RL_DR1.16
  Bottom 0.254: v110.88,27.69 110.37,27.69 107.32,24.64 R2.2
N$3
  Top 0.254: IR_LED_OUT.K 107.32,3.05 107.83,3.05 109.86,5.08 109.86,7.87 107.32,10.41 107.32,14.22 R2.1
N$4  (via drill 0.4)
  Top 0.254: v51.19,32.51 51.19,33.02 50.93,33.27 50.93,33.78 51.95,34.8 63.13,34.8 67.19,38.86 R12.1
  Bottom 0.254: v51.19,32.51 51.19,31.24 39,19.05 30.11,19.05 LED_VOL1.K
N$5
  Bottom 0.254: SERIAL_COM.1 62.62,3.3 74.05,14.73 PCB2.14
N$6
  Bottom 0.254: SERIAL_COM.2 65.16,3.3 76.59,14.73 PCB2.15
N$7
  Top 0.254: LED_DR1.11 82.43,53.59 81.16,53.59 77.6,57.15 R5.2
N$8
  Top 0.254: OPT_SW2.1 116.21,4.57 116.21,7.37 110.62,12.95 K4.S1
N$9
  Top 0.254: OPT_SW2.3 111.13,4.57 111.13,7.37 108.34,10.16 108.34,16 110.37,18.03 K4.O1
N$10  (via drill 0.4)
  Top 0.254: v50.17,31.75 50.17,33.78 51.7,35.31 61.09,35.31 67.19,41.4 R11.1
  Bottom 0.254: v50.17,31.75 45.35,26.92 43.57,26.92 39,22.35 37.98,22.35 LED_VOL2.K
N$11
  Top 0.254: R6.2 8.52,45.72 R21.2
  Bottom 0.254: SW2.E 17.41,38.1 17.41,40.64 14.61,43.43 14.61,45.72 R21.2
N$12
  Top 0.254: LED_VOL3.K 44.08,28.45 51.44,35.81 59.06,35.81 67.19,43.94 R10.1
N$13
  Top 0.254: LED_VOL4.K 47.38,36.32 56.52,36.32 66.68,46.48 67.19,46.48 R9.1
N$14
  Top 0.254: LED_VOL5.K 47.38,44.96 63.13,44.96 67.19,49.02 R8.1
N$15  (via drill 0.4)
  Top 0.254: v50.43,49.53 65.16,49.53 67.19,51.56 R7.1
  Bottom 0.254: v50.43,49.53 47.38,52.58 44.08,52.58 LED_VOL6.K
N$16
  Top 0.254: LED_VOL7.K 37.98,58.67 62.87,58.67 67.19,54.36 R4.1
N$17
  Top 0.254: LED_VOL8.K 30.11,61.98 31.63,61.98 33.15,60.45 64.14,60.45 67.19,57.4 R5.1
N$18
  Top 0.254: LED_DR2.11 82.18,34.54 79.13,34.54 77.6,36.07 R13.2
N$19
  Top 0.254: LED_DR2.12 82.18,33.27 77.86,33.27 77.6,33.53 R14.2
N$21
  Top 0.254: LED_DR2.13 82.18,31.75 78.11,31.75 77.6,31.24 R15.2
N$22
  Top 0.254: LED_DR2.14 82.18,30.48 79.38,30.48 77.6,28.7 R16.2
N$23
  Top 0.254: LED_DR2.15 82.18,29.21 80.65,29.21 77.6,26.16 R17.2
N$24
  Top 0.254: LED_DR2.16 82.18,27.94 81.67,27.94 77.35,23.62 R18.2
N$25
  Top 0.254: LED_DR2.17 82.18,26.67 81.67,26.67 78.87,23.88 78.87,22.35 77.6,21.08 R19.2
N$26
  Top 0.254: LED_DR2.18 82.18,25.4 82.18,23.11 77.6,18.54 R20.2
N$27
  Top 0.254: OPT_SW1.1 125.86,1.78 124.85,1.78 123.32,3.3 123.07,3.3 122.31,4.06 122.31,6.1 129.17,12.95 K7.S2
N$28
  Top 0.254: 32.65,34.8 32.65,37.34 32.14,37.85 SW2.B | 32.65,34.8 32.65,34.29 R27.2 32.65,34.8 | 32.65,34.8 35.69,31.75 42.81,31.75 R22.2
N$29
  Top 0.254: LED_DR1.12 82.43,52.32 79.38,52.32 77.6,54.1 R4.2
N$31
  Top 0.254: LED_DR1.13 82.43,51.05 78.11,51.05 77.6,51.56 R7.2
N$32
  Top 0.254: OPT_SW.2 123.58,4.32 124.09,4.32 125.1,3.3 126.88,3.3 134.25,10.67 134.25,15.75 130.44,19.56 125.61,19.56 121.8,15.75 K7.P1
N$33
  Top 0.254: LED_DR1.14 82.43,49.53 77.86,49.53 77.6,49.28 R8.2
N$34
  Top 0.254: LED_DR1.15 82.43,48.26 79.13,48.26 77.6,46.74 R9.2
N$35
  Top 0.254: LED_DR1.16 82.43,46.99 80.4,46.99 77.6,44.2 R10.2
N$36
  Top 0.254: LED_DR1.17 82.43,45.72 81.67,45.72 77.6,41.66 R11.2
N$37
  Top 0.254: LED_DR1.18 82.43,44.45 82.43,43.94 77.6,39.12 R12.2
N$38
  Top 0.508: 6V_TRF_SEC.3 151.77,4.83 156.6,4.83 6V_TRF_SEC.4 156.6,5.08 148.72,12.95 GBU6D.AC1
N$39
  Top 0.508: 143.64,4.83 146.44,4.83 6V_TRF_SEC.2 | 143.64,4.83 141.61,4.83 6V_TRF_SEC.1 | 143.64,4.83 143.64,12.95 GBU6D.AC2
N$40
  Top 0.254: OPT_SW1.3 120.78,1.78 120.78,3.05 119.77,4.06 119.77,6.1 127.39,13.72 127.39,16.26 129.17,18.03 K7.O2
N$41  (via drill 0.4)
  Top 0.254: v25.03,18.8 21.47,18.8 LED_VOL9.K | v52.97,32.26 63.38,32.26 67.19,36.07 R13.1
  Bottom 0.254: v25.03,18.8 25.79,18.8 26.8,17.78 38.49,17.78 v52.97,32.26
N$42  (via drill 0.4)
  Top 0.254: v24.01,19.81 21.72,22.1 13.6,22.1 LED_VOL10.K | v52.97,27.94 61.6,27.94 67.19,33.53 R14.1
  Bottom 0.254: v24.01,19.81 24.01,18.54 25.28,17.27 38.74,17.27 49.41,27.94 v52.97,27.94
N$43  (via drill 0.4)
  Top 0.254: v31.88,28.19 7.5,28.19 LED_VOL11.K | v38.23,28.19 42.55,23.88 53.73,23.88 v55.51,22.1
  Bottom 0.254: v38.23,28.19 v31.88,28.19 | v55.51,22.1 58.3,22.1 67.19,30.99 R15.1
N$53  (via drill 0.4)
  Top 0.254: v29.6,29.21 29.09,28.7 12.58,28.7 5.21,36.07 4.2,36.07 LED_VOL12.K | v36.71,27.18 37.22,27.18 37.98,26.42 38.49,26.42 44.84,20.07 v56.01,20.07
  Bottom 0.254: v29.6,29.21 31.63,27.18 v36.71,27.18 | v56.01,20.07 57.03,20.07 65.41,28.45 67.19,28.45 R16.1
N$54  (via drill 0.4)
  Top 0.254: v27.82,29.72 27.31,29.21 12.83,29.21 4.2,37.85 4.2,44.7 LED_VOL13.K | v36.71,25.91 38.23,25.91 45.09,19.05 v56.78,19.05
  Bottom 0.254: v27.82,29.72 31.63,25.91 v36.71,25.91 | v56.78,19.05 63.63,25.91 67.19,25.91 R17.1
N$55  (via drill 0.4)
  Top 0.254: v51.95,33.53 62.87,33.53 66.68,37.34 67.95,37.34 68.71,36.58 68.71,24.89 67.44,23.62 R18.1
  Bottom 0.254: v51.95,33.53 48.14,37.34 44.33,37.34 36.71,44.96 32.14,44.96 24.52,52.58 7.5,52.58 LED_VOL14.K
N$56
  Bottom 0.508: K3.P1 182.76,34.29 178.7,38.35 178.7,40.39 180.47,42.16 201.05,42.16 202.83,40.39 X3.3
N$57  (via drill 0.4)
  Top 0.254: v28.84,32.77 28.84,45.97 16.14,58.67 13.6,58.67 LED_VOL15.K | v35.95,29.21 38.23,26.92 38.74,26.92 42.3,23.37 52.97,23.37 55.25,21.08 56.52,21.08 v58.3,19.3
  Bottom 0.254: v28.84,32.77 29.85,32.77 33.41,29.21 v35.95,29.21 | v58.3,19.3 65.67,19.3 67.19,20.83 R19.1
N$58  (via drill 0.4)
  Top 0.254: v52.2,43.69 53.47,43.69 54.24,44.45 63.63,44.45 66.94,47.75 67.7,47.75 69.22,46.23 69.22,20.32 67.44,18.54 R20.1
  Bottom 0.254: v52.2,43.69 44.08,43.69 42.3,45.47 32.39,45.47 21.47,56.39 21.47,61.98 LED_VOL16.K
N$59  (via drill 0.4)
  Top 0.254: v125.86,8.13 125.86,4.57 OPT_SW.1
  Bottom 0.254: v125.86,8.13 125.36,8.13 123.83,9.65 123.83,10.92 121.8,12.95 K7.S1
N$60
  Bottom 0.254: SERIAL_COM1.1 75.57,3.3 75.57,11.43 78.87,14.73 PCB2.16
N$61
  Bottom 0.254: SERIAL_COM1.2 78.11,3.3 78.11,11.43 81.41,14.73 PCB2.17
N$62
  Top 0.254: R28.1 32.9,46.48 32.9,43.94 32.14,43.18 SW2.A
  Bottom 0.254: R23.2 42.81,49.28 35.69,49.28 33.15,46.74 R28.1
N$64
  Top 0.254: OPT_SW3.1 116.47,1.78 117.99,3.3 117.99,8.13 115.96,10.16 115.96,10.92 117.99,12.95 K4.S2
N$65
  Bottom 0.508: K3.P2 190.63,34.04 199.02,34.04 202.83,30.23 X3.1
N$73
  Top 0.508: 6V_TRF_PRIM.1 202.83,48.77 201.3,48.77 197.49,52.58 197.49,67.56 F1.2
N$74  (via drill 0.4)
  Top 0.254: v124.85,9.91 121.04,6.1 121.04,4.57 OPT_SW.3
  Bottom 0.254: v124.85,9.91 124.85,14.99 121.8,18.03 K7.O1
N$75  (via drill 0.4)
  Top 0.254: v20.2,41.91 20.2,50.29 12.33,58.17 12.33,59.44 12.83,59.94 35.95,59.94 36.71,59.18 36.71,58.42 37.47,57.66 v50.68,57.66
  Bottom 0.254: v20.2,41.91 20.2,17.02 14.36,11.18 14.36,8.13 U$1.9 | v50.68,57.66 56.01,62.99 PCB2.A0
N$84  (via drill 0.4)
  Top 0.254: v42.81,37.59 42.81,44.7 52.46,54.36 v52.46,55.37
  Bottom 0.254: v42.81,37.59 35.95,44.45 31.88,44.45 27.57,48.77 15.63,48.77 13.09,46.23 13.09,44.2 15.63,41.66 15.63,22.61 11.82,18.8 11.82,8.13 U$1.10 | v52.46,55.37 52.46,57.91 56.27,61.72 57.28,61.72 58.55,62.99 PCB2.A1
N$85  (via drill 0.4)
  Top 0.254: v21.72,14.73 22.23,14.73 26.3,18.8 26.3,22.35 v29.85,25.91 | v34.68,35.81 39.25,40.39 39.25,44.45 43.06,48.26 44.08,48.26 v53.47,57.66
  Bottom 0.254: v21.72,14.73 15.63,8.64 15.63,7.37 14.36,6.1 14.36,2.03 U$5.9 | v29.85,25.91 26.8,28.96 26.8,32 30.61,35.81 v34.68,35.81 | v53.47,57.66 55.76,57.66 61.09,62.99 PCB2.A2
N$86  (via drill 0.4)
  Top 0.254: v55.76,65.79 61.09,65.79 63.63,63.25 PCB2.A3
  Bottom 0.254: v55.76,65.79 48.39,65.79 44.58,69.6 19.95,69.6 2.93,52.58 2.93,14.99 11.56,6.35 11.56,2.03 U$5.10
N$123  (via drill 0.4)
  Top 0.254: v112.66,8.64 112.66,4.06 111.39,2.79 111.39,1.78 OPT_SW3.3 | v114.94,14.99 117.99,18.03 K4.O2
  Bottom 0.254: v112.66,8.64 112.66,12.7 v114.94,14.99
N$138
  Top 0.254: PWR_LED.1 135.01,1.78 135.01,2.54 132.98,4.57 R31.1
N$139
  Top 0.508: 184.03,10.41 184.03,15.75 X2.1 | 184.03,10.41 184.03,4.83 X1.1 | 165.23,10.41 165.23,15.75 X5.1 | 165.23,10.41 165.23,4.83 X4.1 | 165.23,10.41 184.03,10.41
  Bottom 0.508: K5.P1 161.17,34.04 159.65,34.04 156.34,30.73 156.34,25.91 164.98,17.27 164.98,16 X5.1
N$141  (via drill 0.4)
  Top 0.508: X1.3 194.19,4.83 194.19,15.75 X2.3 | v153.04,37.59 153.04,37.08 153.3,36.83 153.3,30.73 163.2,20.83 170.57,20.83 175.39,16 X5.3
  Bottom 0.508: 175.39,10.92 175.39,15.75 X5.3 | 175.39,10.92 175.39,4.83 X4.3 | 175.39,10.92 189.11,10.92 193.94,15.75 X2.3 | v153.04,37.59 157.61,42.16 171.33,42.16 172.85,40.64 172.85,38.1 169.04,34.29 K5.P2
PWM_EXT
  Top 0.254: U$5.7 19.44,2.03 19.44,7.87 U$1.7 19.44,8.13 20.96,9.65 31.12,9.65 36.2,14.73 36.71,14.73 PCB2.12
PWM_EXT2
  Top 0.254: U$5.8 16.9,2.03 16.9,7.87 U$1.8
  Bottom 0.254: PCB2.10 41.79,14.73 41.28,14.73 36.71,10.16 32.39,10.16 30.87,8.64 30.87,7.37 30.11,6.6 24.01,6.6 23.25,7.37 23.25,8.38 22.49,9.14 17.91,9.14 16.9,8.13 U$1.8
PWM_TFT  (via drill 0.4)
  Top 0.254: v10.8,10.92 29.85,10.92 33.66,14.73 34.17,14.73 PCB2.13 | v45.6,67.31 46.87,67.31 48.39,65.79 54.49,65.79 60.08,71.37 160.92,71.37 163.96,68.33 U$3.LITE
  Bottom 0.254: v10.8,10.92 10.8,20.32 12.33,21.84 12.33,35.56 6.23,41.66 6.23,53.34 10.55,57.66 16.14,57.66 20.2,61.72 20.2,66.04 23.25,69.09 43.82,69.09 v45.6,67.31
RL1
  Top 0.254: 159.14,56.13 159.65,56.13 161.17,54.61 K5.2 | 159.14,56.13 123.83,56.13 RL_DR1.15 | 159.14,56.13 162.44,59.44 C4.2
RL2  (via drill 0.4)
  Top 0.254: RL_DR1.14 123.83,54.86 155.84,54.86 158.38,52.32 v158.5,52.32 | C6.2 183.78,59.44 183.78,55.37 183.01,54.61 K3.2
  Bottom 0.254: K3.2 182.76,54.36 181.49,53.09 159.39,53.09 158.63,52.32 v158.5,52.32
RL3  (via drill 0.4)
  Top 0.254: K7.10 129.17,20.83 129.17,23.62 128.4,24.38 C13.2 | v120.78,53.59 123.58,53.59 RL_DR1.13
  Bottom 0.254: v120.78,53.59 115.2,48.01 115.2,39.37 128.15,26.42 128.15,24.64 C13.2
RL4
  Top 0.254: RL_DR1.12 123.58,52.32 122.82,52.32 118.5,48.01 118.5,25.65 117.48,24.64 C2.2
  Bottom 0.254: K4.10 117.99,20.83 117.99,23.88 117.48,24.38 C2.2
RL5
  Top 0.254: RL_DR1.11 123.83,51.05 130.69,51.05 142.37,39.37 146.18,39.37 147.45,38.1 C5.2 147.71,37.85 148.47,37.08 148.47,34.04 K1.10
SCK  (via drill 0.4)
  Top 0.254: U$5.5 24.52,2.03 24.52,7.87 U$1.5 | U$3.SCK 161.42,68.07 160.92,68.07 153.8,60.96 105.8,60.96 103.77,58.93 102.75,58.93 102.24,59.44 98.94,59.44 97.92,58.42 97.92,56.9 99.19,55.63 PCB2.52 | v66.17,9.4 75.06,18.29 v75.06,46.23
  Bottom 0.254: v66.17,9.4 50.68,9.4 46.87,5.59 28.58,5.59 25.03,2.03 24.52,2.03 U$5.5 | v75.06,46.23 75.57,46.23 77.1,47.75 93.1,47.75 97.92,52.58 97.92,54.1 99.19,55.37 PCB2.52
SW_ENC1  (via drill 0.4)
  Top 0.254: R27.1 42.81,34.29 42.81,35.81 40.52,38.1 C32.2 | v48.39,31.24 63.63,16 63.63,14.99 PCB2.2
  Bottom 0.254: v48.39,31.24 45.85,31.24 43.06,34.04 R27.1
SW_ENC2  (via drill 0.4)
  Top 0.254: C33.2 40.52,43.18 40.52,43.94 43.06,46.48 R28.2 | v53.47,24.89 53.98,24.89 61.09,17.78 61.09,14.99 PCB2.3
  Bottom 0.254: v53.47,24.89 53.47,27.18 53.98,27.69 53.98,32.77 43.82,42.93 40.52,42.93 C33.2
SW_PUSH  (via drill 0.4)
  Top 0.254: 10.8,37.34 11.31,37.85 C31.2 | 10.8,37.34 9.02,35.56 8.52,35.56 R6.1 | v54.49,18.03 45.09,18.03 39,24.13 v33.92,24.13 | v23.76,30.23 17.91,30.23 10.8,37.34
  Bottom 0.254: v54.49,18.03 55.76,16.76 83.95,16.76 85.73,14.99 86.49,14.99 PCB2.19 | v33.92,24.13 29.85,24.13 v23.76,30.23
TFT_CS  (via drill 0.4)
  Top 0.254: v47.89,25.15 45.35,25.15 42.81,27.69 42.81,29.72 46.11,33.02 46.11,46.48 v55.25,55.63
  Bottom 0.254: v47.89,25.15 39.5,16.76 39.5,14.99 PCB2.11 | v55.25,55.63 85.48,55.63 91.57,61.72 101.23,61.72 103.26,63.75 149.74,63.75 154.06,68.07 U$3.CS
TFT_INT  (via drill 0.4)
  Top 0.254: v88.02,52.32 88.53,51.82 88.53,40.64 84.21,36.32 84.21,14.99 PCB2.18 | v95.64,59.94 100.46,64.77 v114.18,64.77
  Bottom 0.254: v95.64,59.94 v88.02,52.32 | v114.18,64.77 143.14,64.77 146.44,68.07 U$3.INT
TFT_RST  (via drill 0.4)
  Top 0.254: v40.27,21.59 46.87,14.99 PCB2.8 | v43.06,25.15 42.55,25.15 36.46,31.24 34.68,31.24 32.9,33.02 32.14,33.02 30.61,34.54 30.61,45.97 32.9,48.26 39,48.26 42.3,51.56 44.58,51.56 v49.66,56.64
  Bottom 0.254: v40.27,21.59 40.27,22.35 v43.06,25.15 | v49.66,56.64 49.66,58.42 63.13,71.88 147.96,71.88 151.52,68.33 U$3.RST
TFT_WAIT  (via drill 0.4)
  Top 0.254: v59.82,17.78 59.06,17.02 51.44,17.02 47.89,13.46 46.36,13.46 45.09,14.73 44.58,14.73 PCB2.9 | v70.49,22.35 70.49,56.39 v74.05,59.94 | v76.59,62.48 80.4,66.29 v126.37,66.29 | v128.91,66.29 130.18,66.29 131.2,65.28 146.18,65.28 148.98,68.07 U$3.WAIT
  Bottom 0.254: v59.82,17.78 65.16,17.78 67.19,19.81 67.95,19.81 v70.49,22.35 | v76.59,62.48 v74.05,59.94 | v128.91,66.29 v126.37,66.29
TFT_X+  (via drill 0.4)
  Top 0.254: v129.17,69.34 82.18,69.34 74.56,61.72 73.29,61.72 72.02,62.99 71.51,62.99 PCB2.A6
  Bottom 0.254: v129.17,69.34 130.69,69.34 131.2,69.85 135.01,69.85 136.53,68.33 U$3.X+
TFT_X-  (via drill 0.4)
  Top 0.254: v81.16,70.36 74.05,63.25 PCB2.A7
  Bottom 0.254: v81.16,70.36 137.04,70.36 139.07,68.33 U$3.X-
TFT_Y+
  Bottom 0.254: PCB2.A9 81.41,63.25 81.41,68.58 82.18,69.34 110.88,69.34 114.94,65.28 141.1,65.28 143.9,68.07 U$3.Y+
TFT_Y-
  Bottom 0.254: PCB2.A8 79.13,63.25 79.13,69.6 80.91,71.37 138.31,71.37 141.36,68.33 U$3.Y-
V_RECT
  Top 0.508: OPT_SW4.1 147.96,19.05 153.8,13.21 GBU6D.+
  Bottom 0.508: 136.53,41.91 129.93,41.91 123.83,35.81 C11.+ | 136.53,41.91 142.37,41.91 LM323T.1 | 136.53,41.91 143.14,35.31 143.14,26.67 147.71,22.1 147.71,19.3 OPT_SW4.1
V_RECT1  (via drill 0.4)
  Top 0.508: v106.31,7.11 52.71,7.11 51.7,8.13 34.68,8.13 U$1.1
  Bottom 0.508: v106.31,7.11 128.66,7.11 131.45,9.91 131.45,19.05 132.98,20.57 134.5,20.57 140.09,26.16 140.85,26.16 K1.S1
V_RECT2  (via drill 0.4)
  Top 0.508: v107.07,6.1 52.71,6.1 51.44,7.37 40.01,7.37 34.68,2.03 U$5.1
  Bottom 0.508: v107.07,6.1 128.66,6.1 132.21,9.65 132.21,10.16 138.56,16.51 147.71,16.51 150.76,19.56 150.76,24.38 149.99,25.15 149.74,25.15 148.72,26.16 K1.S2
V_RECT_SEL
  Top 0.508: OPT_SW4.2 145.42,19.3 145.42,25.65 148.47,28.7 K1.P2 148.22,28.7 141.1,28.7 K1.P1
VOL_CS
  Top 0.254: U$5.4 27.06,2.03 27.06,7.87 U$1.4 27.06,8.13 28.07,9.14 47.38,9.14 52.97,14.73 53.47,14.73 PCB2.6

### Text on the board
tNames: 220V AC | Pre 1 main | Pre 2 main | RIAA | Pre 1 sec | Pre 2 sec
tValues: IR In | Triggers | reg/unreg | +5V out | 1 | RS232 | RS232 | Pwr Led | 1 | TxRxGn5v | TxRxGn5v | - / + | 1. +5V Unreg / 2. MOSI / 3. GND / 4. VOL_CS / 5. SCK / 6. MUX_CS / 7. PWM / 8. PWM2 / 9. VU1 / 10. VU2